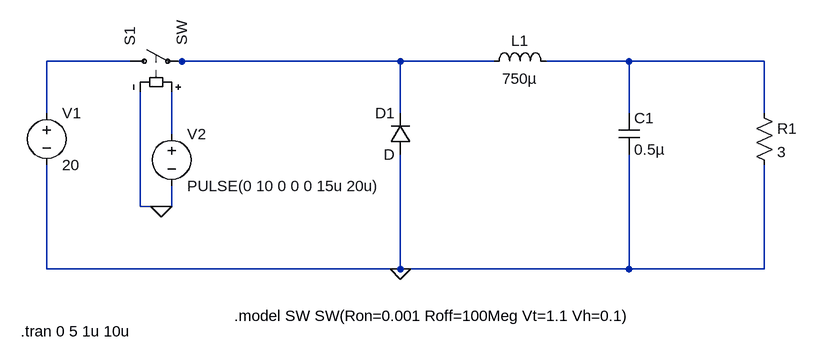
[diagram p0: schematic buck_converter.asc]
buck_converter.asc, the LTspice schematic file:
Version 4.1
SHEET 1 1208 680
WIRE 176 32 48 32
WIRE 256 32 240 32
WIRE 592 32 256 32
WIRE 736 32 592 32
WIRE 944 32 816 32
WIRE 1152 32 944 32
WIRE 48 112 48 32
WIRE 592 112 592 32
WIRE 944 112 944 32
WIRE 1152 112 1152 32
WIRE 240 144 240 80
WIRE 192 256 192 80
WIRE 224 256 192 256
WIRE 240 256 240 224
WIRE 240 256 224 256
WIRE 48 352 48 192
WIRE 592 352 592 176
WIRE 592 352 48 352
WIRE 944 352 944 176
WIRE 944 352 592 352
WIRE 1152 352 1152 192
WIRE 1152 352 944 352
FLAG 592 352 0
FLAG 224 256 0
SYMBOL voltage 48 96 R0
SYMATTR InstName V1
SYMATTR Value 20
SYMBOL voltage 240 128 R0
WINDOW 123 0 0 Left 0
WINDOW 39 0 0 Left 0
SYMATTR InstName V2
SYMATTR Value PULSE(0 10 0 0 0 15u 20u)
SYMBOL diode 608 176 R180
WINDOW 0 24 64 Left 2
WINDOW 3 24 0 Left 2
SYMATTR InstName D1
SYMBOL ind 720 48 R270
WINDOW 0 32 56 VTop 2
WINDOW 3 5 56 VBottom 2
SYMATTR InstName L1
SYMATTR Value 750µ
SYMBOL cap 928 112 R0
SYMATTR InstName C1
SYMATTR Value 0.5µ
SYMBOL res 1136 96 R0
SYMATTR InstName R1
SYMATTR Value 3
SYMBOL sw 160 32 R270
SYMATTR InstName S1
TEXT 336 424 Left 2 !.model SW SW(Ron=0.001 Roff=100Meg Vt=1.1 Vh=0.1)
TEXT 8 448 Left 2 !.tran 0 5 1u 10u

The netlist it stands for:
* buck_converter.asc
V1 N001 0 20
V2 N004 0 PULSE(0 10 0 0 0 15u 20u)
D1 0 N002 D
L1 N002 N003 750µ
C1 N003 0 0.5µ
R1 N003 0 3
S1 N001 N002 N004 0 SW
.model D D
.lib standard.dio
.model SW SW(Ron=0.001 Roff=100Meg Vt=1.1 Vh=0.1)
.tran 0 5 1u 10u
.backanno
.end